# EasyEDA schematic basic_nmea_wifi_2021-01-28.json
TITLE: Sheet_1; REV: 1.0; Date: 2021-01-20; Sheet: 1/1; Drawn By: ilemauris; Company: Your Company
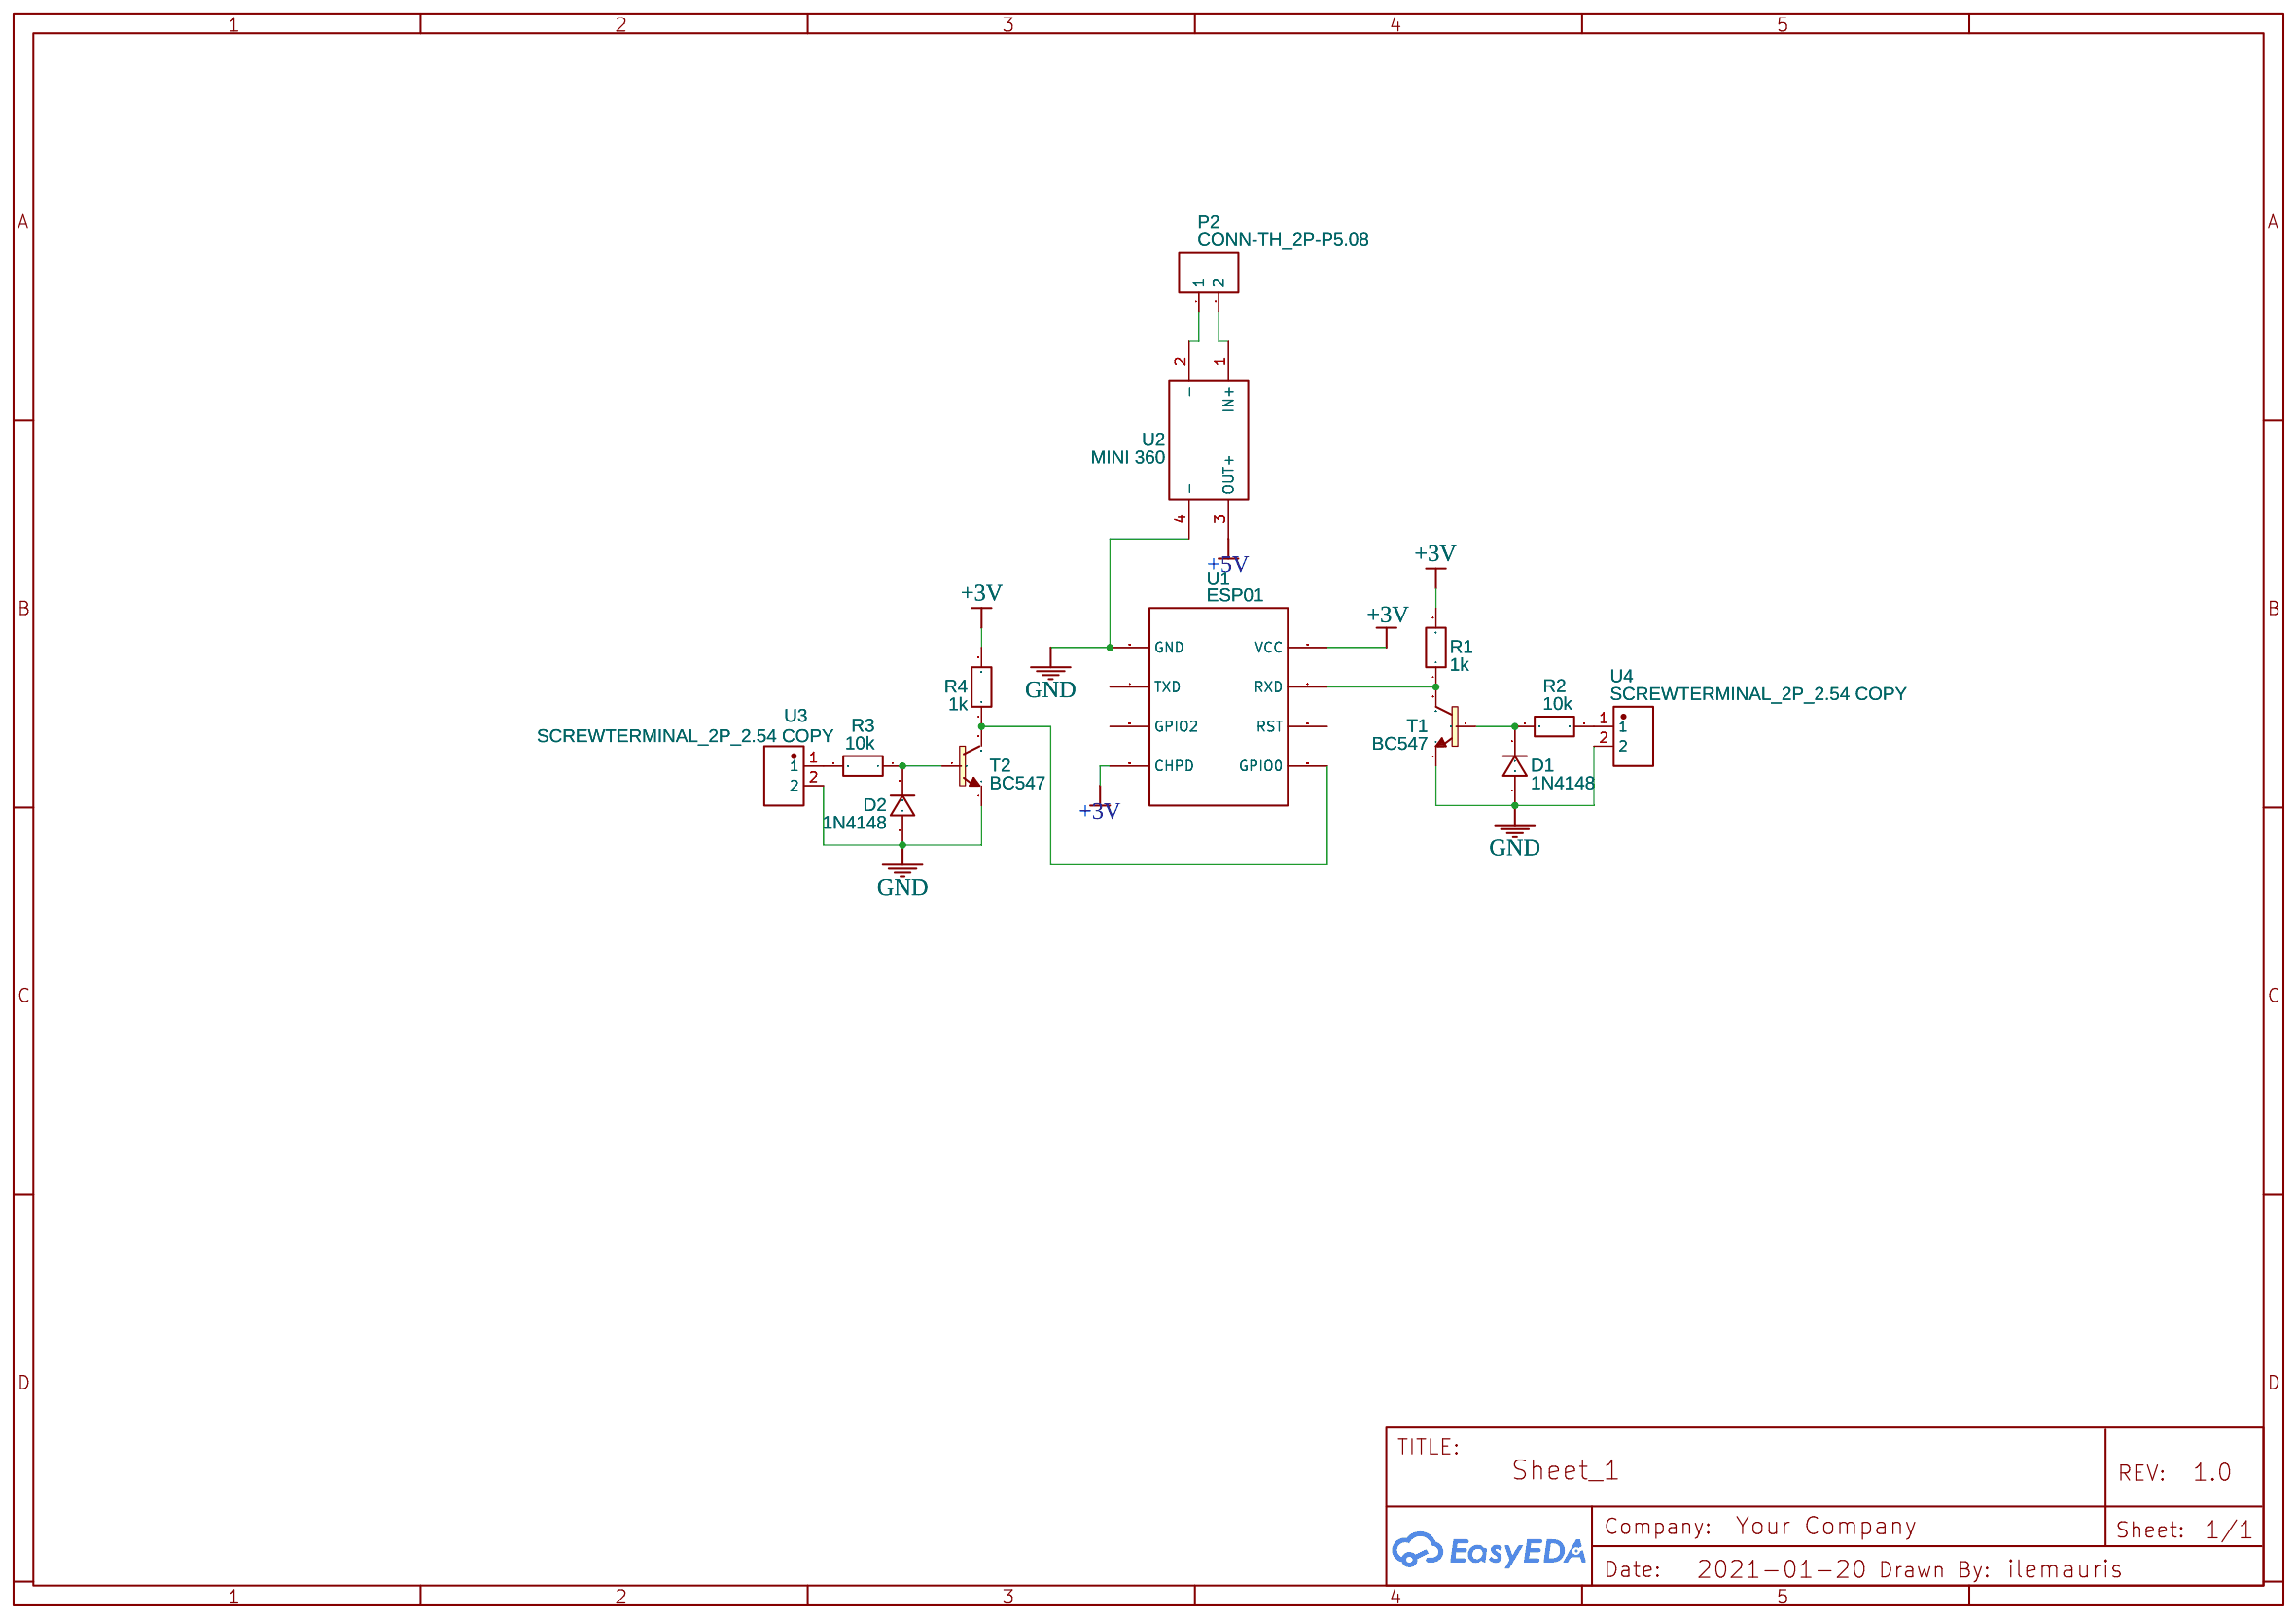
[diagram p0: schematic sheet]

## Parts
D1  1N4148  [DO-35_BD2.0-L4.0-P8.00-D0.5-FD]
D2  1N4148  [DO-35_BD2.0-L4.0-P8.00-D0.5-FD]
P2  CONN-TH_2P-P5.08  [CONN-TH_2P-P5.08]
R1  1k  [R_AXIAL-0.3]
R2  10k  [R_AXIAL-0.3]
R3  10k  [R_AXIAL-0.3]
R4  1k  [R_AXIAL-0.3]
T1  BC547  [TO92]
T2  BC547  [TO92]
U1  ESP01  [ESP8266 (ESP01)]
U2  MINI 360  [MINI 360]
U3  SCREWTERMINAL_2P_2.54 COPY  [CONN-TH_DG308-2.54-02P]
U4  SCREWTERMINAL_2P_2.54 COPY  [CONN-TH_DG308-2.54-02P]

## Library data of the parts
D1 D2 = 1N4148: Supplier: LCSC; Manufacturer: SEMTECH; Supplier Part: C14516; Contributor: LCEDA_Lib
P2 = CONN-TH_2P-P5.08: Supplier: LCSC; Contributor: LCEDA_Lib
R1-R4 = R_AXIAL-0.3_EU: Contributor: LCEDA_Lib
T1 T2 = BC547: Contributor: Breno.Malta
U1 = ESP01: Manufacturer Part: Espressif; Contributor: Michaël Pégeot; Supplier: LCSC; Manufacturer: Espressif
U2 = MINI 360: Contributor: myskq
U3 U4 = SCREWTERMINAL_2P_2.54 COPY: Supplier: reichelt; Supplier Part: DG308 2,54-2; Manufacturer: DEGSON; Manufacturer Part: DG308-2.54-02P-14-00A(H); Contributor: M&M's; link: https://www.reichelt.de/leiterplattenklemme-2-polig-rm-2-54-mm-dg308-2-54-2-p276214.html?&trstct=pos_0&nbc=1

## Nets
+3V: R1.2 R4.2 U1.CH_PD(CHPD) U1.VCC
+5V: U2.3(OUT+)
GND: D1.1 D2.1 T1.1(E) T2.1(E) U1.GND U2.4(-) U3.2 U4.2
Net-(D1-2): D1.2 R2.1 T1.2(B)
Net-(D2-2): D2.2 R3.1 T2.2(B)
Net-(P2-1): P2.1 U2.2(-)
Net-(P2-2): P2.2 U2.1(IN+)
Net-(R1-1): R1.1 T1.3(C) U1.RX(RXD)
Net-(R2-2): R2.2 U4.1
Net-(R3-2): R3.2 U3.1
Net-(R4-1): R4.1 T2.3(C) U1.GPIO0

Not connected (* = marked no-connect by the designer): U1 GPIO2 RST TX(TXD)
